# Altium schematic sheet ETHERNET.SchDoc
size A4; SheetNumber: 3; SheetTotal: 4
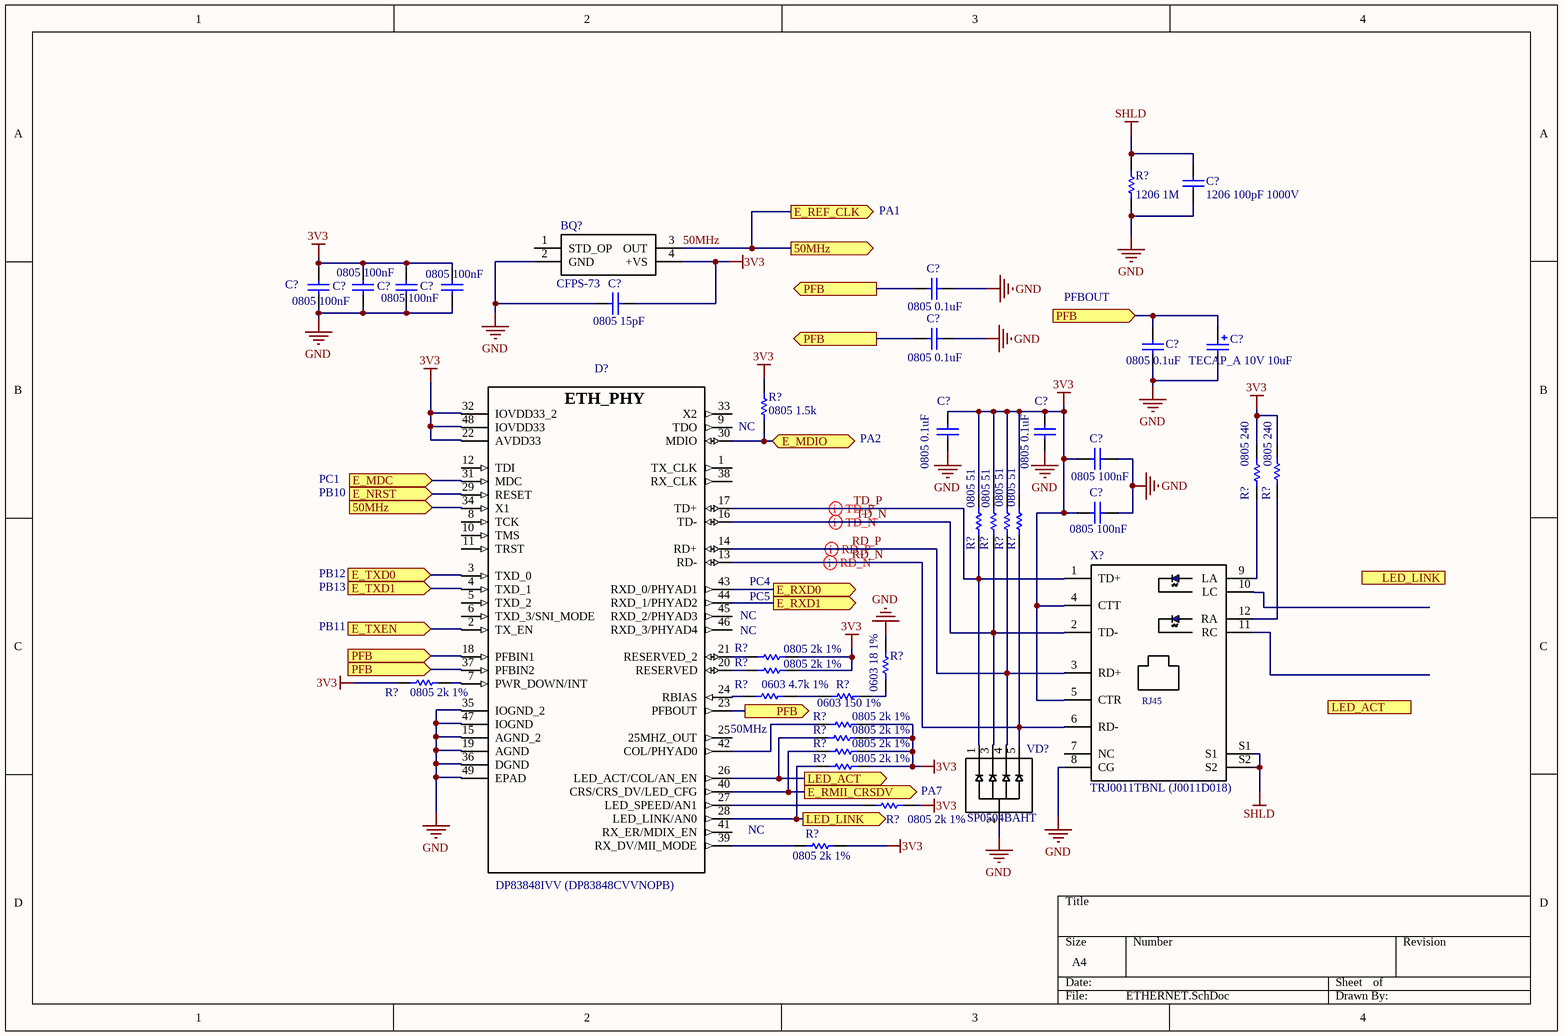
[diagram p0: ETHERNET.SchDoc]

## Parts
(Parts that share a designator on the sheet are numbered #1, #2 ... from top to bottom, then left to right.)
BQ?  CFPS-73  [CFPS-73]
C?#1  1206 100pF 1000V  [CAP SMD1206]
C?#2  0805 0.1uF  [C_SMD0805]
C?#3  0805 100nF  [C_SMD0805]
C?#4  0805 100nF  [C_SMD0805]
C?#5  0805 100nF  [C_SMD0805]
C?#6  0805 100nF  [C_SMD0805]
C?#7  0805 15pF  [C_SMD0805]
C?#8  0805 0.1uF  [C_SMD0805]
C?#9  0805 0.1uF  [C_SMD0805]
C?#10  TECAP_A 10V 10uF  [TECAP_A]
C?#11  0805 0.1uF  [C_SMD0805]
C?#12  0805 0.1uF  [C_SMD0805]
C?#13  0805 100nF  [C_SMD0805]
C?#14  0805 100nF  [C_SMD0805]
D?  DP83848IVV (DP83848CVVNOPB)  [QFP48]
R?#1  1206 1M  [R_SMD1206]
R?#2  0805 1.5k  [R_SMD0805]
R?#3  0805 240  [R_SMD0805]
R?#4  0805 240  [R_SMD0805]
R?#5  0805 51  [R_SMD0805]
R?#6  0805 51  [R_SMD0805]
R?#7  0805 51  [R_SMD0805]
R?#8  0805 51  [R_SMD0805]
R?#9  0805 2k 1%  [R_SMD0805]
R?#10  0603 18 1%  [R_SMD0603]
R?#11  0805 2k 1%  [R_SMD0805]
R?#12  0805 2k 1%  [R_SMD0805]
R?#13  0603 4.7k 1%  [R_SMD0603]
R?#14  0603 150 1%  [R_SMD0603]
R?#15  0805 2k 1%  [R_SMD0805]
R?#16  0805 2k 1%  [R_SMD0805]
R?#17  0805 2k 1%  [R_SMD0805]
R?#18  0805 2k 1%  [R_SMD0805]
R?#19  0805 2k 1%  [R_SMD0805]
R?#20  0805 2k 1%  [R_SMD0805]
VD?  SP0504BAHT  [SOT23-5]
X?  TRJ0011TBNL (J0011D018)  [J0011D018]

## Ports
50MHz (in), 50MHz (out), E_MDC (in), E_MDIO (bidir), E_NRST (in), E_REF_CLK (out), E_RMII_CRSDV (out), E_RXD0 (out), E_RXD1 (out), E_TXD0 (in), E_TXD1 (in), E_TXEN (in), LED_ACT (in), LED_ACT (out), LED_LINK (in), LED_LINK (out), PFB (in), PFB (out)

## Nets
3V3: BQ?.4(+VS) C?#3.1 C?#4.1 C?#5.1 C?#6.1 C?#7.2 C?#11.2 C?#12.2 C?#13.1 C?#14.1 D?.22(AVDD33) D?.32(IOVDD33_2) D?.48(IOVDD33) R?#2.2 R?#3.2 R?#4.2 R?#5.2 R?#6.2 R?#7.2 R?#8.2 R?#9.2 R?#11.2 R?#12.2 R?#15.2 R?#16.2 R?#17.2 R?#18.2 R?#19.2 R?#20.2 X?.4(CTT) X?.5(CTR)
GND: BQ?.2(GND) C?#1.1 C?#2.2 C?#3.2 C?#4.2 C?#5.2 C?#6.2 C?#7.1 C?#8.2 C?#9.2 C?#10.2 C?#11.1 C?#12.1 C?#13.2 C?#14.2 D?.15(AGND_2) D?.19(AGND) D?.35(IOGND_2) D?.36(DGND) D?.47(IOGND) D?.49(EPAD) R?#1.1 R?#10.2 VD?.2(GND) X?.8(CG)
SHLD: C?#1.2 R?#1.2 X?.S1 X?.S2
50MHz: BQ?.3(OUT) D?.34(X1) ; port 50MHz, port E_REF_CLK
E_MDC: D?.31(MDC) ; port E_MDC
E_MDIO: D?.30(MDIO) R?#2.1 ; port E_MDIO
E_NRST: D?.29(RESET) ; port E_NRST
E_RMII_CRSDV: D?.40(CRS/CRS_DV/LED_CFG) R?#17.1 ; port E_RMII_CRSDV
E_RXD0: D?.43(RXD_0/PHYAD1) ; port E_RXD0
E_RXD1: D?.44(RXD_1/PHYAD2) ; port E_RXD1
E_TXD0: D?.3(TXD_0) ; port E_TXD0
E_TXD1: D?.4(TXD_1) ; port E_TXD1
E_TXEN: D?.2(TX_EN) ; port E_TXEN
LED_ACT: D?.26(LED_ACT/COL/AN_EN) R?#16.1 ; port LED_ACT
LED_LINK: D?.28(LED_LINK/AN0) R?#18.1 ; port LED_LINK
PFB: C?#2.1 C?#8.1 C?#9.1 C?#10.1 D?.18(PFBIN1) D?.23(PFBOUT) D?.37(PFBIN2) ; port PFB
RD_N: D?.13(RD-) R?#8.1 VD?.5(D) X?.6(RD-)
RD_P: D?.14(RD+) R?#7.1 VD?.4(B) X?.3(RD+)
TD_N: D?.16(TD-) R?#6.1 VD?.3(C) X?.2(TD-)
TD_P: D?.17(TD+) R?#5.1 VD?.1(A) X?.1(TD+)
NetD?_7: D?.7(PWR_DOWN/INT) R?#12.1
NetD?_20: D?.20(RESERVED) R?#11.1
NetD?_21: D?.21(RESERVED_2) R?#9.1
NetD?_24: D?.24(RBIAS) R?#13.1
NetD?_27: D?.27(LED_SPEED/AN1) R?#19.1
NetD?_39: D?.39(RX_DV/MII_MODE) R?#20.1
NetD?_42: D?.42(COL/PHYAD0) R?#15.1
NetR?#3_1: R?#3.1 X?.12(RA)
NetR?#4_1: R?#4.1 X?.9(LA)
NetR?#10_1: R?#10.1 R?#14.2
NetR?#13_2: R?#13.2 R?#14.1

Not connected (* = marked no-connect by the designer): BQ? 1(STD_OP); D? 1(TX_CLK) 5(TXD_2) 6(TXD_3/SNI_MODE) 8(TCK) 9(TDO) 10(TMS) 11(TRST) 12(TDI) 25(25MHZ_OUT) 33(X2) 38(RX_CLK) 41(RX_ER/MDIX_EN) 45(RXD_2/PHYAD3) 46(RXD_3/PHYAD4); X? 7(NC) 10(LC) 11(RC)

## Layout directives
differential pair: RD_N, RD_P, TD_N, TD_P

## Notes on the sheet
- PA1
- PFBOUT
- (near R?#2) NC
- PA2
- PC1
- PB10
- PB12
- PC4
- PB13
- PB11
- NC
- (near R?#9) NC
- PC5
- 50MHz
- (near R?#19) PA7
- (in symbol DP83848CVVNOPB) ETH_PHY
- (in symbol RJ45 J0011D018) RJ45

## Library data of the parts
BQ? = SPXO018044CFPS-73: IQD FREQUENCY PRODUCTS - SPXO018044-CFPS-73 - OSCILLATOR FREQUENCY, 50MHZ
C?#1 = C1206: SMD Cap 1206; Published: 17-Jul-2002; LatestRevisionDate: 19-Mar-2004; LatestRevisionNote: Silkscreen size reduced.; DatasheetDocument: Mar-2001; PackageDocument: Mar-2001; PackageReference: 1206; Publisher: Altium Limited; Code_JEITA: 1206; Code_IPC: 3216 [1206]; ComponentLink1Description: Manufacturer Link; ComponentLink1URL: http://www.kemet.com/; ComponentLink2Description: Datasheet; ComponentLink2URL: http://www.kemet.com/kemet/web/homepage/kechome.nsf/vapubfilesname/F3102TA.pdf/$file/F3102TA.pdf
C?#2-C?#9 C?#11-C?#14 = C0805: SMD Cap 0805; Note: Footprint corresponds to dimensions for bulk cassette packaging. This case size has tightened tolerances.; Published: 17-Jul-2002; LatestRevisionDate: 19-Mar-2004; LatestRevisionNote: Silkscreen size reduced.; DatasheetDocument: Mar-2001; PackageDocument: Mar-2001; PackageReference: 0805; Publisher: Altium Limited; Code_JEITA: 0805; Code_IPC: 2012[0805]; ComponentLink1Description: Manufacturer Link; ComponentLink1URL: http://www.kemet.com/; ComponentLink2Description: Datasheet; ComponentLink2URL: http://www.kemet.com/kemet/web/homepage/kechome.nsf/vapubfilesname/F3102TA.pdf/$file/F3102TA.pdf
C?#10 = TECAP_A: Tantalum pol cap type A
D? = DP83848CVVNOPB: ETH Transciever
R?#1 = R1206: SMD Res 1206
R?#2-R?#9 R?#11 R?#12 R?#15-R?#20 = R0805: SMD Res 0805
R?#10 R?#13 R?#14 = R0603: SMD Res 0603
VD? = SP0504BAHT: TVS Diode-4
X? = RJ45 J0011D018: Conn RJ-45 F 8 POS 2.54mm Solder RA Thru-Hole 12 Terminal 1 Port Cat 5/Cat 6